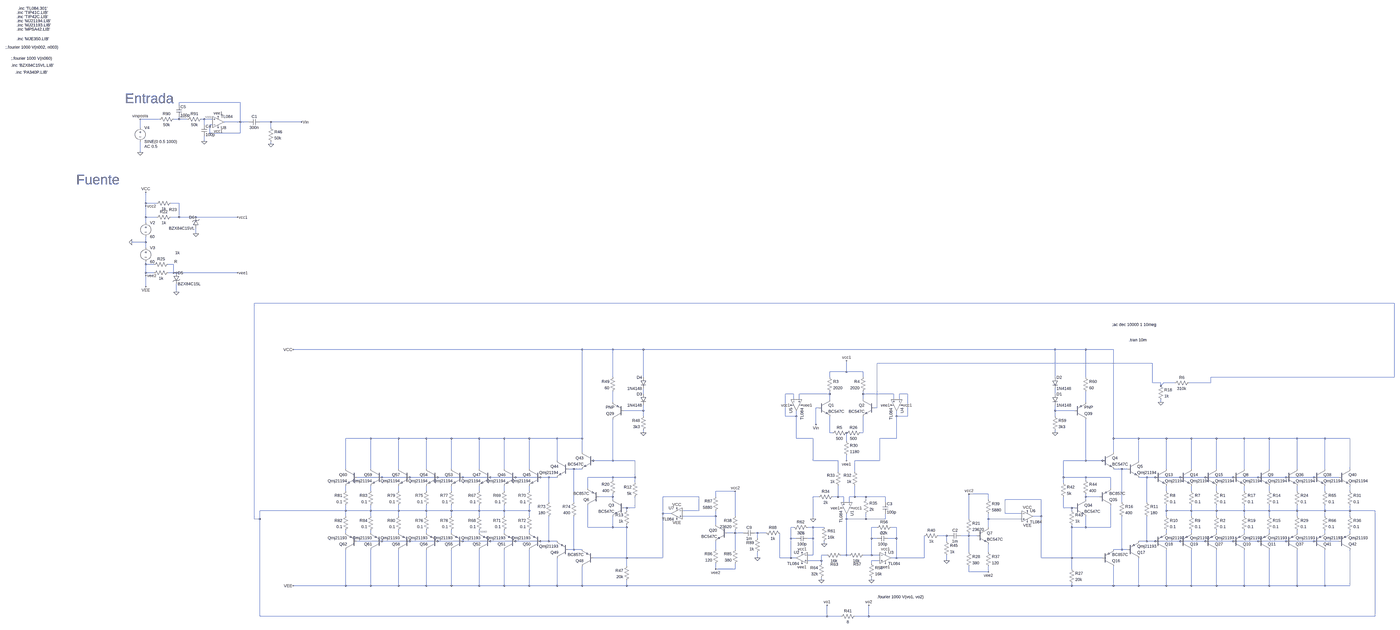
[diagram p0: schematic V6.asc, whole sheet]
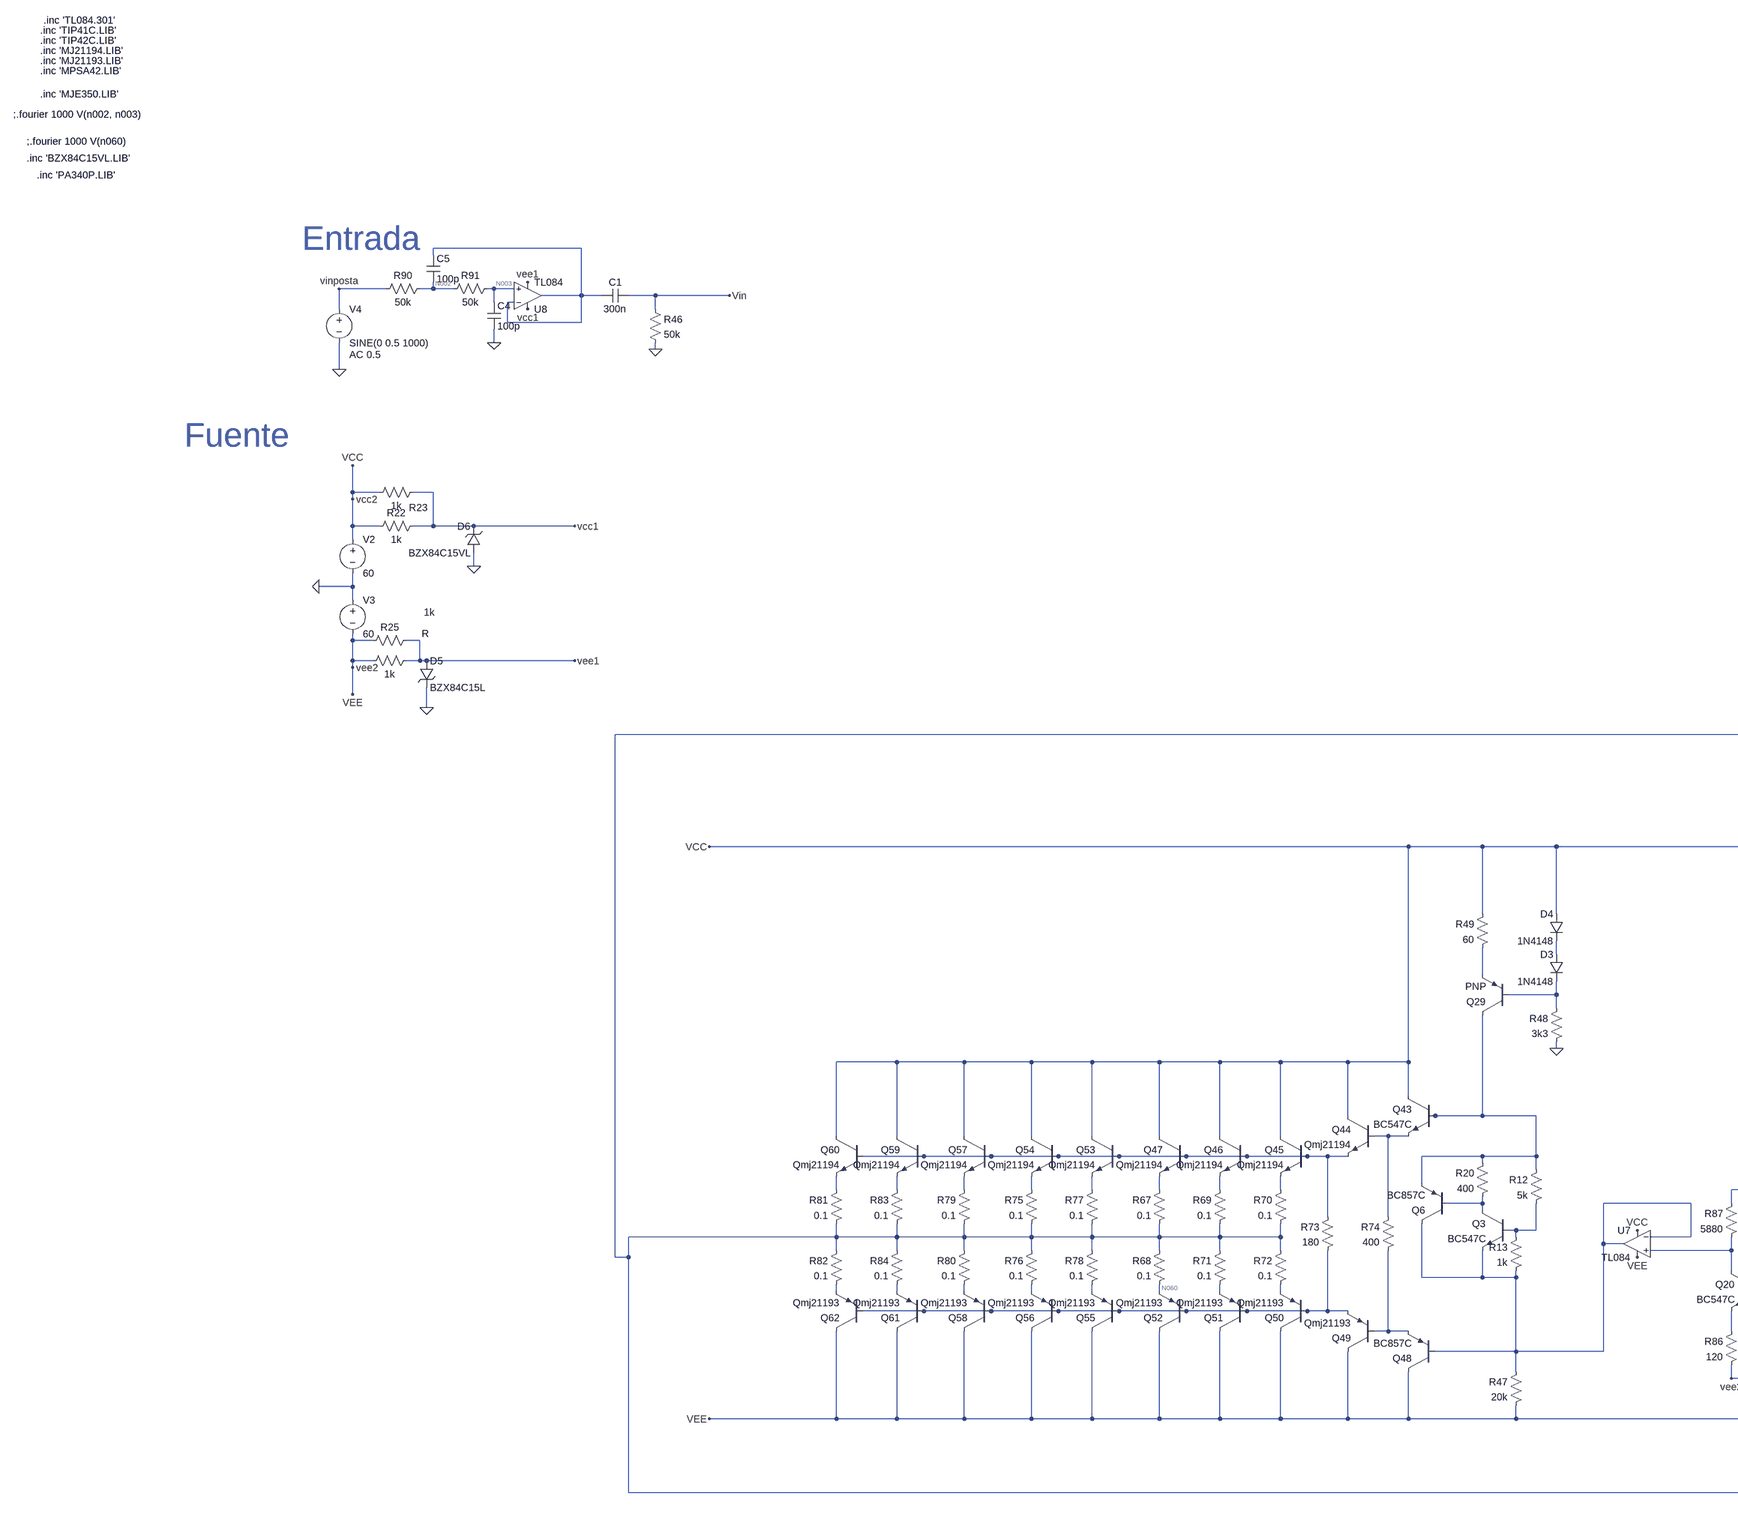
[diagram p1: schematic V6.asc, part, row 1 of 1, column 1 of 2]
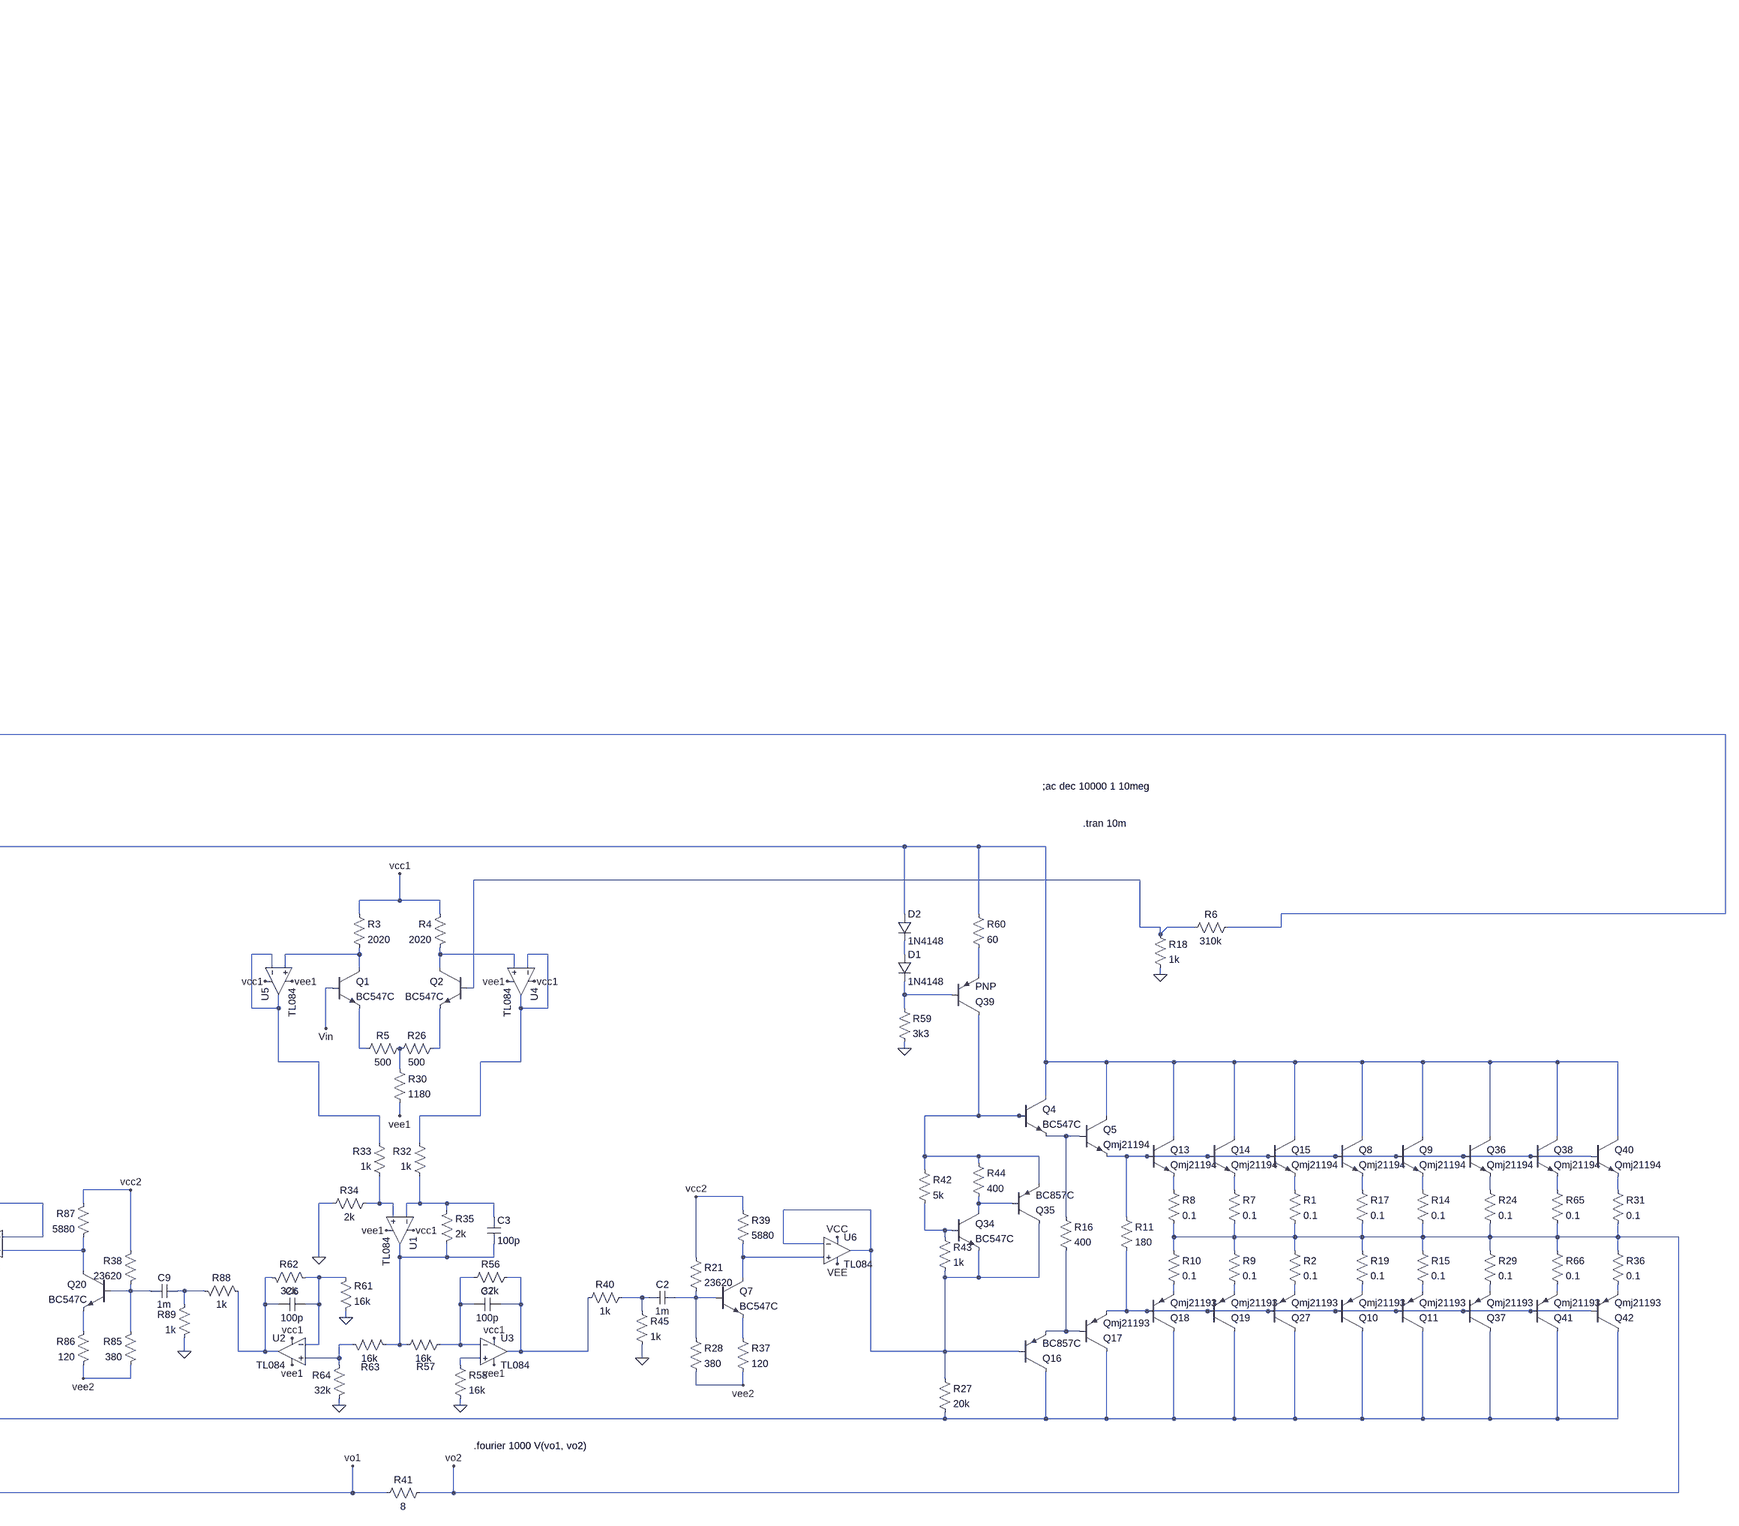
[diagram p2: schematic V6.asc, part, row 1 of 1, column 2 of 2]
V6.asc, the LTspice schematic file:
Version 4
SHEET 1 14776 5396
WIRE 4192 -160 3840 -160
WIRE 3840 -144 3840 -160
WIRE 3728 -64 3616 -64
WIRE 3840 -64 3840 -80
WIRE 3840 -64 3808 -64
WIRE 3888 -64 3840 -64
WIRE 3984 -64 3968 -64
WIRE 4032 -64 3984 -64
WIRE 4192 -48 4192 -160
WIRE 4192 -48 4096 -48
WIRE 4240 -48 4192 -48
WIRE 4368 -48 4304 -48
WIRE 4544 -48 4368 -48
WIRE 3984 -32 3984 -64
WIRE 4032 -32 4016 -32
WIRE 3616 -16 3616 -64
WIRE 4368 -16 4368 -48
WIRE 4016 16 4016 -32
WIRE 4192 16 4192 -48
WIRE 4192 16 4016 16
WIRE 3984 64 3984 32
WIRE 4368 80 4368 64
WIRE 3616 128 3616 64
WIRE 3648 976 3648 912
WIRE 3712 976 3648 976
WIRE 3840 976 3792 976
WIRE 3648 992 3648 976
WIRE 3648 1056 3648 992
WIRE 3712 1056 3648 1056
WIRE 3840 1056 3840 976
WIRE 3840 1056 3792 1056
WIRE 3936 1056 3840 1056
WIRE 4176 1056 3936 1056
WIRE 3648 1088 3648 1056
WIRE 3936 1152 3936 1120
WIRE 3648 1200 3648 1168
WIRE 3648 1200 3568 1200
WIRE 3648 1232 3648 1200
WIRE 3648 1328 3648 1312
WIRE 3696 1328 3648 1328
WIRE 3808 1328 3776 1328
WIRE 3648 1376 3648 1328
WIRE 3696 1376 3648 1376
WIRE 3808 1376 3808 1328
WIRE 3808 1376 3776 1376
WIRE 3824 1376 3808 1376
WIRE 4176 1376 3824 1376
WIRE 3648 1392 3648 1376
WIRE 3648 1456 3648 1392
WIRE 3824 1488 3824 1440
WIRE 10832 1552 4272 1552
WIRE 6160 2000 4496 2000
WIRE 6336 2000 6160 2000
WIRE 6512 2000 6336 2000
WIRE 8880 2000 6512 2000
WIRE 9056 2000 8880 2000
WIRE 9216 2000 9056 2000
WIRE 9440 2080 7856 2080
WIRE 7680 2128 7680 2064
WIRE 7680 2128 7584 2128
WIRE 7776 2128 7680 2128
WIRE 6336 2160 6336 2000
WIRE 6512 2160 6512 2000
WIRE 7584 2160 7584 2128
WIRE 7776 2160 7776 2128
WIRE 8880 2160 8880 2000
WIRE 9056 2160 9056 2000
WIRE 10832 2160 10832 1552
WIRE 10832 2160 9776 2160
WIRE 9440 2192 9440 2080
WIRE 9488 2192 9440 2192
WIRE 9568 2192 9504 2192
WIRE 9776 2192 9776 2160
WIRE 9776 2192 9648 2192
WIRE 9488 2208 9488 2192
WIRE 9488 2208 9504 2192
WIRE 6512 2256 6512 2224
WIRE 7376 2256 7328 2256
WIRE 7584 2256 7584 2240
WIRE 7584 2256 7408 2256
WIRE 7776 2256 7776 2240
WIRE 7952 2256 7776 2256
WIRE 8032 2256 7984 2256
WIRE 8880 2256 8880 2224
WIRE 7376 2288 7376 2256
WIRE 7408 2288 7408 2256
WIRE 7584 2288 7584 2256
WIRE 7776 2288 7776 2256
WIRE 7952 2288 7952 2256
WIRE 7984 2288 7984 2256
WIRE 6336 2304 6336 2240
WIRE 9056 2304 9056 2240
WIRE 9488 2304 9488 2288
WIRE 7520 2336 7504 2336
WIRE 7856 2336 7856 2080
WIRE 7856 2336 7840 2336
WIRE 6512 2352 6512 2320
WIRE 6512 2352 6400 2352
WIRE 8880 2352 8880 2320
WIRE 8992 2352 8880 2352
WIRE 6512 2384 6512 2352
WIRE 7328 2384 7328 2256
WIRE 7392 2384 7392 2352
WIRE 7392 2384 7328 2384
WIRE 7968 2384 7968 2352
WIRE 8032 2384 8032 2256
WIRE 8032 2384 7968 2384
WIRE 8880 2384 8880 2352
WIRE 7504 2432 7504 2336
WIRE 6512 2480 6512 2464
WIRE 7584 2480 7584 2384
WIRE 7600 2480 7584 2480
WIRE 7776 2480 7776 2384
WIRE 7776 2480 7760 2480
WIRE 8880 2480 8880 2464
WIRE 4944 2512 4800 2512
WIRE 5104 2512 4944 2512
WIRE 5264 2512 5104 2512
WIRE 5408 2512 5264 2512
WIRE 5568 2512 5408 2512
WIRE 5712 2512 5568 2512
WIRE 5856 2512 5712 2512
WIRE 6016 2512 5856 2512
WIRE 6160 2512 6160 2000
WIRE 6160 2512 6016 2512
WIRE 7392 2512 7392 2384
WIRE 7488 2512 7392 2512
WIRE 7968 2512 7968 2384
WIRE 7968 2512 7872 2512
WIRE 9216 2512 9216 2000
WIRE 9360 2512 9216 2512
WIRE 9520 2512 9360 2512
WIRE 9664 2512 9520 2512
WIRE 9808 2512 9664 2512
WIRE 9968 2512 9808 2512
WIRE 10112 2512 9968 2512
WIRE 10272 2512 10112 2512
WIRE 10432 2512 10272 2512
WIRE 10576 2512 10432 2512
WIRE 7680 2528 7680 2480
WIRE 6160 2592 6160 2512
WIRE 9216 2592 9216 2512
WIRE 6016 2640 6016 2512
WIRE 6224 2640 6208 2640
WIRE 6336 2640 6336 2400
WIRE 6336 2640 6224 2640
WIRE 6464 2640 6336 2640
WIRE 7488 2640 7488 2512
WIRE 7632 2640 7488 2640
WIRE 7680 2640 7680 2608
WIRE 7872 2640 7872 2512
WIRE 7872 2640 7728 2640
WIRE 9056 2640 9056 2400
WIRE 9056 2640 8928 2640
WIRE 9152 2640 9056 2640
WIRE 9168 2640 9152 2640
WIRE 9360 2640 9360 2512
WIRE 4800 2688 4800 2512
WIRE 4944 2688 4944 2512
WIRE 5104 2688 5104 2512
WIRE 5264 2688 5264 2512
WIRE 5408 2688 5408 2512
WIRE 5568 2688 5568 2512
WIRE 5712 2688 5712 2512
WIRE 5856 2688 5856 2512
WIRE 6112 2688 6080 2688
WIRE 6160 2688 6112 2688
WIRE 9264 2688 9216 2688
WIRE 9296 2688 9264 2688
WIRE 9520 2688 9520 2512
WIRE 9664 2688 9664 2512
WIRE 9808 2688 9808 2512
WIRE 9968 2688 9968 2512
WIRE 10112 2688 10112 2512
WIRE 10272 2688 10272 2512
WIRE 10432 2688 10432 2512
WIRE 10576 2688 10576 2512
WIRE 7632 2704 7632 2640
WIRE 7728 2704 7728 2640
WIRE 5008 2736 4864 2736
WIRE 5168 2736 5008 2736
WIRE 5328 2736 5168 2736
WIRE 5472 2736 5328 2736
WIRE 5632 2736 5472 2736
WIRE 5776 2736 5632 2736
WIRE 5920 2736 5776 2736
WIRE 5968 2736 5920 2736
WIRE 6016 2736 5968 2736
WIRE 6336 2736 6192 2736
WIRE 6464 2736 6464 2640
WIRE 6464 2736 6336 2736
WIRE 8928 2736 8928 2640
WIRE 9056 2736 8928 2736
WIRE 9200 2736 9056 2736
WIRE 9408 2736 9360 2736
WIRE 9456 2736 9408 2736
WIRE 9600 2736 9456 2736
WIRE 9744 2736 9600 2736
WIRE 9904 2736 9744 2736
WIRE 10048 2736 9904 2736
WIRE 10208 2736 10048 2736
WIRE 10368 2736 10208 2736
WIRE 10512 2736 10368 2736
WIRE 6336 2752 6336 2736
WIRE 9056 2752 9056 2736
WIRE 6464 2768 6464 2736
WIRE 8928 2768 8928 2736
WIRE 6192 2800 6192 2736
WIRE 9200 2800 9200 2736
WIRE 4800 2816 4800 2784
WIRE 4944 2816 4944 2784
WIRE 5104 2816 5104 2784
WIRE 5264 2816 5264 2784
WIRE 5408 2816 5408 2784
WIRE 5568 2816 5568 2784
WIRE 5712 2816 5712 2784
WIRE 5856 2816 5856 2784
WIRE 7040 2816 6928 2816
WIRE 9520 2816 9520 2784
WIRE 9664 2816 9664 2784
WIRE 9808 2816 9808 2784
WIRE 9968 2816 9968 2784
WIRE 10112 2816 10112 2784
WIRE 10272 2816 10272 2784
WIRE 10432 2816 10432 2784
WIRE 10576 2816 10576 2784
WIRE 8496 2832 8384 2832
WIRE 6336 2848 6336 2832
WIRE 6336 2848 6256 2848
WIRE 6832 2848 6624 2848
WIRE 6928 2848 6928 2816
WIRE 7520 2848 7488 2848
WIRE 7632 2848 7632 2784
WIRE 7632 2848 7600 2848
WIRE 7664 2848 7632 2848
WIRE 7728 2848 7728 2784
WIRE 7728 2848 7696 2848
WIRE 7792 2848 7728 2848
WIRE 7904 2848 7792 2848
WIRE 9056 2848 9056 2832
WIRE 9136 2848 9056 2848
WIRE 6336 2864 6336 2848
WIRE 7792 2864 7792 2848
WIRE 8496 2864 8496 2832
WIRE 8800 2864 8592 2864
WIRE 9056 2864 9056 2848
WIRE 5968 2880 5968 2736
WIRE 6112 2880 6112 2688
WIRE 7664 2880 7664 2848
WIRE 7696 2880 7696 2848
WIRE 7904 2880 7904 2848
WIRE 9264 2880 9264 2688
WIRE 9408 2880 9408 2736
WIRE 6416 2912 6400 2912
WIRE 6464 2912 6464 2848
WIRE 6464 2912 6416 2912
WIRE 8928 2912 8928 2848
WIRE 8976 2912 8928 2912
WIRE 8992 2912 8976 2912
WIRE 4800 2928 4800 2896
WIRE 4800 2928 4304 2928
WIRE 4944 2928 4944 2896
WIRE 4944 2928 4800 2928
WIRE 5104 2928 5104 2896
WIRE 5104 2928 4944 2928
WIRE 5264 2928 5264 2896
WIRE 5264 2928 5104 2928
WIRE 5408 2928 5408 2896
WIRE 5408 2928 5264 2928
WIRE 5568 2928 5568 2896
WIRE 5568 2928 5408 2928
WIRE 5712 2928 5712 2896
WIRE 5712 2928 5568 2928
WIRE 5856 2928 5856 2896
WIRE 5856 2928 5712 2928
WIRE 6416 2928 6416 2912
WIRE 6832 2928 6832 2848
WIRE 6832 2928 6736 2928
WIRE 8976 2928 8976 2912
WIRE 9520 2928 9520 2896
WIRE 9664 2928 9664 2896
WIRE 9664 2928 9520 2928
WIRE 9808 2928 9808 2896
WIRE 9808 2928 9664 2928
WIRE 9968 2928 9968 2896
WIRE 9968 2928 9808 2928
WIRE 10112 2928 10112 2896
WIRE 10112 2928 9968 2928
WIRE 10272 2928 10272 2896
WIRE 10272 2928 10112 2928
WIRE 10432 2928 10432 2896
WIRE 10432 2928 10272 2928
WIRE 10576 2928 10576 2896
WIRE 10576 2928 10432 2928
WIRE 10720 2928 10576 2928
WIRE 6624 2944 6624 2848
WIRE 6672 2944 6624 2944
WIRE 8592 2944 8592 2864
WIRE 8688 2944 8592 2944
WIRE 4800 2960 4800 2928
WIRE 4944 2960 4944 2928
WIRE 5104 2960 5104 2928
WIRE 5264 2960 5264 2928
WIRE 5408 2960 5408 2928
WIRE 5568 2960 5568 2928
WIRE 5712 2960 5712 2928
WIRE 5856 2960 5856 2928
WIRE 6928 2960 6928 2928
WIRE 6928 2960 6736 2960
WIRE 7040 2960 7040 2816
WIRE 8800 2960 8800 2864
WIRE 8800 2960 8752 2960
WIRE 9520 2960 9520 2928
WIRE 9664 2960 9664 2928
WIRE 9808 2960 9808 2928
WIRE 9968 2960 9968 2928
WIRE 10112 2960 10112 2928
WIRE 10272 2960 10272 2928
WIRE 10432 2960 10432 2928
WIRE 10576 2960 10576 2928
WIRE 4272 2976 4272 1552
WIRE 4304 2976 4304 2928
WIRE 4304 2976 4272 2976
WIRE 7488 2976 7488 2848
WIRE 7680 2976 7680 2944
WIRE 7792 2976 7792 2944
WIRE 7792 2976 7680 2976
WIRE 7904 2976 7904 2944
WIRE 7904 2976 7792 2976
WIRE 8384 2976 8384 2832
WIRE 8496 2976 8496 2944
WIRE 8688 2976 8496 2976
WIRE 6928 3008 6928 2960
WIRE 6192 3024 6192 2896
WIRE 6336 3024 6336 2960
WIRE 6336 3024 6192 3024
WIRE 6416 3024 6416 3008
WIRE 6416 3024 6336 3024
WIRE 7376 3024 7360 3024
WIRE 7488 3024 7456 3024
WIRE 7552 3024 7488 3024
WIRE 7856 3024 7824 3024
WIRE 7968 3024 7936 3024
WIRE 8496 3024 8496 2976
WIRE 8976 3024 8976 3008
WIRE 9056 3024 9056 2960
WIRE 9056 3024 8976 3024
WIRE 9200 3024 9200 2896
WIRE 9200 3024 9056 3024
WIRE 4800 3056 4800 3040
WIRE 4944 3056 4944 3040
WIRE 5104 3056 5104 3040
WIRE 5264 3056 5264 3040
WIRE 5408 3056 5408 3040
WIRE 5568 3056 5568 3040
WIRE 5712 3056 5712 3040
WIRE 5856 3056 5856 3040
WIRE 7040 3056 7040 3040
WIRE 7040 3056 6992 3056
WIRE 7088 3056 7040 3056
WIRE 7168 3056 7152 3056
WIRE 7216 3056 7168 3056
WIRE 9520 3056 9520 3040
WIRE 9664 3056 9664 3040
WIRE 9808 3056 9808 3040
WIRE 9968 3056 9968 3040
WIRE 10112 3056 10112 3040
WIRE 10272 3056 10272 3040
WIRE 10432 3056 10432 3040
WIRE 10576 3056 10576 3040
WIRE 8256 3072 8208 3072
WIRE 8272 3072 8256 3072
WIRE 8384 3072 8384 3056
WIRE 8384 3072 8336 3072
WIRE 8432 3072 8384 3072
WIRE 7168 3088 7168 3056
WIRE 7360 3088 7360 3024
WIRE 7392 3088 7360 3088
WIRE 7488 3088 7488 3024
WIRE 7488 3088 7456 3088
WIRE 7824 3088 7824 3024
WIRE 7856 3088 7824 3088
WIRE 7968 3088 7968 3024
WIRE 7968 3088 7920 3088
WIRE 5008 3104 4864 3104
WIRE 5168 3104 5008 3104
WIRE 5328 3104 5168 3104
WIRE 5472 3104 5328 3104
WIRE 5632 3104 5472 3104
WIRE 5776 3104 5632 3104
WIRE 5920 3104 5776 3104
WIRE 5968 3104 5968 2960
WIRE 5968 3104 5920 3104
WIRE 6016 3104 5968 3104
WIRE 8256 3104 8256 3072
WIRE 9408 3104 9408 2960
WIRE 9408 3104 9360 3104
WIRE 9456 3104 9408 3104
WIRE 9600 3104 9456 3104
WIRE 9744 3104 9600 3104
WIRE 9904 3104 9744 3104
WIRE 10048 3104 9904 3104
WIRE 10208 3104 10048 3104
WIRE 10368 3104 10208 3104
WIRE 10512 3104 10368 3104
WIRE 7552 3120 7552 3104
WIRE 6112 3152 6112 2960
WIRE 6112 3152 6080 3152
WIRE 6160 3152 6112 3152
WIRE 6928 3152 6928 3104
WIRE 7040 3152 7040 3056
WIRE 9264 3152 9264 2960
WIRE 9264 3152 9216 3152
WIRE 9296 3152 9264 3152
WIRE 8384 3168 8384 3072
WIRE 8496 3168 8496 3120
WIRE 7488 3184 7488 3088
WIRE 7488 3184 7456 3184
WIRE 7568 3184 7536 3184
WIRE 7680 3184 7680 2976
WIRE 7680 3184 7648 3184
WIRE 7696 3184 7680 3184
WIRE 7824 3184 7824 3088
WIRE 7824 3184 7776 3184
WIRE 7872 3184 7824 3184
WIRE 6416 3200 6416 3024
WIRE 6416 3200 6224 3200
WIRE 6624 3200 6624 2944
WIRE 6624 3200 6416 3200
WIRE 7168 3200 7168 3168
WIRE 7296 3200 7296 3056
WIRE 7360 3200 7360 3088
WIRE 7360 3200 7296 3200
WIRE 7392 3200 7360 3200
WIRE 7968 3200 7968 3088
WIRE 7968 3200 7936 3200
WIRE 8128 3200 8128 3072
WIRE 8128 3200 7968 3200
WIRE 8800 3200 8800 2960
WIRE 8976 3200 8976 3024
WIRE 8976 3200 8800 3200
WIRE 9152 3200 8976 3200
WIRE 7536 3216 7536 3184
WIRE 7536 3216 7456 3216
WIRE 7872 3216 7824 3216
WIRE 8256 3216 8256 3184
WIRE 7536 3232 7536 3216
WIRE 7824 3232 7824 3216
WIRE 6416 3248 6416 3200
WIRE 6928 3264 6928 3232
WIRE 7040 3264 7040 3232
WIRE 7040 3264 6928 3264
WIRE 8976 3264 8976 3200
WIRE 8384 3280 8384 3248
WIRE 8496 3280 8496 3248
WIRE 8496 3280 8384 3280
WIRE 7536 3328 7536 3312
WIRE 7824 3328 7824 3312
WIRE 4800 3360 4800 3152
WIRE 4800 3360 4496 3360
WIRE 4944 3360 4944 3152
WIRE 4944 3360 4800 3360
WIRE 5104 3360 5104 3152
WIRE 5104 3360 4944 3360
WIRE 5264 3360 5264 3152
WIRE 5264 3360 5104 3360
WIRE 5408 3360 5408 3152
WIRE 5408 3360 5264 3360
WIRE 5568 3360 5568 3152
WIRE 5568 3360 5408 3360
WIRE 5712 3360 5712 3152
WIRE 5712 3360 5568 3360
WIRE 5856 3360 5856 3152
WIRE 5856 3360 5712 3360
WIRE 6016 3360 6016 3200
WIRE 6016 3360 5856 3360
WIRE 6160 3360 6160 3248
WIRE 6160 3360 6016 3360
WIRE 6416 3360 6416 3328
WIRE 6416 3360 6160 3360
WIRE 8976 3360 8976 3344
WIRE 8976 3360 6416 3360
WIRE 9216 3360 9216 3248
WIRE 9216 3360 8976 3360
WIRE 9360 3360 9360 3200
WIRE 9360 3360 9216 3360
WIRE 9520 3360 9520 3152
WIRE 9520 3360 9360 3360
WIRE 9664 3360 9664 3152
WIRE 9664 3360 9520 3360
WIRE 9808 3360 9808 3152
WIRE 9808 3360 9664 3360
WIRE 9968 3360 9968 3152
WIRE 9968 3360 9808 3360
WIRE 10112 3360 10112 3152
WIRE 10112 3360 9968 3360
WIRE 10272 3360 10272 3152
WIRE 10272 3360 10112 3360
WIRE 10432 3360 10432 3152
WIRE 10432 3360 10272 3360
WIRE 10576 3360 10576 3152
WIRE 10576 3360 10432 3360
WIRE 4304 3536 4304 2976
WIRE 7568 3536 7568 3472
WIRE 7568 3536 4304 3536
WIRE 7648 3536 7568 3536
WIRE 7808 3536 7808 3472
WIRE 7808 3536 7728 3536
WIRE 10720 3536 10720 2928
WIRE 10720 3536 7808 3536
FLAG 3568 1200 0
FLAG 3616 128 0
FLAG 4544 -48 Vin
FLAG 3648 912 VCC
FLAG 3648 1456 VEE
FLAG 7680 2640 vee1
FLAG 7648 2912 vee1
FLAG 7680 2064 vcc1
FLAG 7712 2912 vcc1
FLAG 3648 992 vcc2
FLAG 3648 1392 vee2
FLAG 8880 2480 0
FLAG 6512 2480 0
FLAG 4496 3360 VEE
FLAG 4496 2000 VCC
FLAG 7488 2976 0
FLAG 7824 3328 0
FLAG 7552 3120 0
FLAG 7536 3328 0
FLAG 3936 1152 0
FLAG 3824 1488 0
FLAG 7568 3472 vo1
FLAG 7808 3472 vo2
FLAG 8000 2320 vcc1
FLAG 7936 2320 vee1
FLAG 7360 2320 vcc1
FLAG 7424 2320 vee1
FLAG 7904 3232 vee1
FLAG 7424 3232 vee1
FLAG 7424 3168 vcc1
FLAG 7904 3168 vcc1
FLAG 4176 1056 vcc1
FLAG 4176 1376 vee1
FLAG 7504 2432 Vin
FLAG 8384 2832 vcc2
FLAG 8496 3280 vee2
FLAG 8256 3216 0
FLAG 8720 2928 VCC
FLAG 8720 2992 VEE
FLAG 7040 2816 vcc2
FLAG 6928 3264 vee2
FLAG 7168 3200 0
FLAG 6704 2912 VCC
FLAG 6704 2976 VEE
FLAG 9488 2304 0
FLAG 3984 64 0
FLAG 4064 -16 vcc1
FLAG 4064 -80 vee1
FLAG 3616 -64 vinposta
FLAG 4368 80 0
SYMBOL npn 9152 2592 R0
SYMATTR InstName Q4
SYMATTR Value BC547C
SYMBOL npn 9296 2640 R0
SYMATTR InstName Q5
SYMATTR Value Qmj21194
SYMBOL npn 9456 2688 R0
SYMATTR InstName Q13
SYMATTR Value Qmj21194
SYMBOL npn 9600 2688 R0
SYMATTR InstName Q14
SYMATTR Value Qmj21194
SYMBOL npn 9744 2688 R0
SYMATTR InstName Q15
SYMATTR Value Qmj21194
SYMBOL pnp 9152 3248 M180
SYMATTR InstName Q16
SYMATTR Value BC857C
SYMBOL pnp 9296 3200 M180
SYMATTR InstName Q17
SYMATTR Value Qmj21193
SYMBOL pnp 9456 3152 M180
SYMATTR InstName Q18
SYMATTR Value Qmj21193
SYMBOL pnp 9600 3152 M180
SYMATTR InstName Q19
SYMATTR Value Qmj21193
SYMBOL pnp 9744 3152 M180
SYMATTR InstName Q27
SYMATTR Value Qmj21193
SYMBOL res 9792 2800 R0
SYMATTR InstName R1
SYMATTR Value 0.1
SYMBOL res 9792 2944 R0
SYMATTR InstName R2
SYMATTR Value 0.1
SYMBOL res 9648 2800 R0
SYMATTR InstName R7
SYMATTR Value 0.1
SYMBOL res 9504 2800 R0
SYMATTR InstName R8
SYMATTR Value 0.1
SYMBOL res 9648 2944 R0
SYMATTR InstName R9
SYMATTR Value 0.1
SYMBOL res 9504 2944 R0
SYMATTR InstName R10
SYMATTR Value 0.1
SYMBOL res 9392 2864 R0
SYMATTR InstName R11
SYMATTR Value 180
SYMBOL res 9248 2864 R0
SYMATTR InstName R16
SYMATTR Value 400
SYMBOL npn 8992 2864 R0
SYMATTR InstName Q34
SYMATTR Value BC547C
SYMBOL res 8912 2752 R0
SYMATTR InstName R42
SYMATTR Value 5k
SYMBOL res 8960 2912 R0
SYMATTR InstName R43
SYMATTR Value 1k
SYMBOL res 9040 2736 R0
SYMATTR InstName R44
SYMATTR Value 400
SYMBOL pnp 9136 2896 M180
SYMATTR InstName Q35
SYMATTR Value BC857C
SYMBOL voltage 3648 1072 R0
WINDOW 123 0 0 Left 0
WINDOW 39 24 44 Left 2
SYMATTR InstName V2
SYMATTR Value 60
SYMBOL voltage 3648 1216 R0
WINDOW 123 0 0 Left 0
WINDOW 39 24 124 Left 2
SYMATTR InstName V3
SYMATTR Value 60
SYMBOL voltage 3616 -32 R0
WINDOW 123 24 124 Left 2
WINDOW 39 0 0 Left 0
SYMATTR Value2 AC 0.5
SYMATTR InstName V4
SYMATTR Value SINE(0 0.5 1000)
SYMBOL npn 7520 2288 R0
SYMATTR InstName Q1
SYMATTR Value BC547C
SYMBOL npn 7840 2288 M0
SYMATTR InstName Q2
SYMATTR Value BC547C
SYMBOL res 7568 2144 R0
SYMATTR InstName R3
SYMATTR Value 2020
SYMBOL res 7792 2144 M0
SYMATTR InstName R4
SYMATTR Value 2020
SYMBOL res 7696 2464 R90
WINDOW 0 0 56 VBottom 2
WINDOW 3 32 56 VTop 2
SYMATTR InstName R5
SYMATTR Value 500
SYMBOL res 7776 2464 R90
WINDOW 0 0 56 VBottom 2
WINDOW 3 32 56 VTop 2
SYMATTR InstName R26
SYMATTR Value 500
SYMBOL res 7664 2512 R0
SYMATTR InstName R30
SYMATTR Value 1180
SYMBOL Opamps\\opamp2 7744 2912 R90
SYMATTR InstName U1
SYMATTR Value TL084
SYMBOL res 7744 2800 R180
WINDOW 0 36 76 Left 2
WINDOW 3 36 40 Left 2
SYMATTR InstName R32
SYMATTR Value 1k
SYMBOL res 7648 2800 R180
WINDOW 0 36 76 Left 2
WINDOW 3 36 40 Left 2
SYMATTR InstName R33
SYMATTR Value 1k
SYMBOL res 7616 2832 R90
WINDOW 0 0 56 VBottom 2
WINDOW 3 32 56 VTop 2
SYMATTR InstName R34
SYMATTR Value 2k
SYMBOL res 7776 2960 M180
WINDOW 0 36 76 Left 2
WINDOW 3 36 40 Left 2
SYMATTR InstName R35
SYMATTR Value 2k
SYMBOL res 8960 3248 R0
SYMATTR InstName R27
SYMATTR Value 20k
SYMBOL pnp 8992 2400 M180
SYMATTR InstName Q39
SYMBOL res 8864 2368 R0
SYMATTR InstName R59
SYMATTR Value 3k3
SYMBOL diode 8864 2256 R0
SYMATTR InstName D1
SYMATTR Value 1N4148
SYMBOL diode 8864 2160 R0
SYMATTR InstName D2
SYMATTR Value 1N4148
SYMBOL res 9040 2144 R0
SYMATTR InstName R60
SYMATTR Value 60
SYMBOL npn 9904 2688 R0
SYMATTR InstName Q8
SYMATTR Value Qmj21194
SYMBOL npn 10048 2688 R0
SYMATTR InstName Q9
SYMATTR Value Qmj21194
SYMBOL pnp 9904 3152 M180
SYMATTR InstName Q10
SYMATTR Value Qmj21193
SYMBOL pnp 10048 3152 M180
SYMATTR InstName Q11
SYMATTR Value Qmj21193
SYMBOL res 10096 2800 R0
SYMATTR InstName R14
SYMATTR Value 0.1
SYMBOL res 10096 2944 R0
SYMATTR InstName R15
SYMATTR Value 0.1
SYMBOL res 9952 2800 R0
SYMATTR InstName R17
SYMATTR Value 0.1
SYMBOL res 9952 2944 R0
SYMATTR InstName R19
SYMATTR Value 0.1
SYMBOL res 6432 3232 M0
SYMATTR InstName R47
SYMATTR Value 20k
SYMBOL pnp 6400 2400 R180
SYMATTR InstName Q29
SYMBOL res 6528 2368 M0
SYMATTR InstName R48
SYMATTR Value 3k3
SYMBOL diode 6528 2256 M0
SYMATTR InstName D3
SYMATTR Value 1N4148
SYMBOL diode 6528 2160 M0
SYMATTR InstName D4
SYMATTR Value 1N4148
SYMBOL res 6352 2144 M0
SYMATTR InstName R49
SYMATTR Value 60
SYMBOL res 7744 3520 R90
WINDOW 0 0 56 VBottom 2
WINDOW 3 32 56 VTop 2
SYMATTR InstName R41
SYMATTR Value 8
SYMBOL res 7952 3008 R90
WINDOW 0 0 56 VBottom 2
WINDOW 3 32 56 VTop 2
SYMATTR InstName R56
SYMATTR Value 32k
SYMBOL res 7792 3168 R90
WINDOW 0 83 50 VBottom 2
WINDOW 3 32 56 VTop 2
SYMATTR InstName R57
SYMATTR Value 16k
SYMBOL res 7808 3216 R0
SYMATTR InstName R58
SYMATTR Value 16k
SYMBOL res 7536 3120 M180
WINDOW 0 36 76 Left 2
WINDOW 3 36 40 Left 2
SYMATTR InstName R61
SYMATTR Value 16k
SYMBOL res 7360 3008 M90
WINDOW 0 0 56 VBottom 2
WINDOW 3 32 56 VTop 2
SYMATTR InstName R62
SYMATTR Value 32k
SYMBOL res 7664 3200 M270
WINDOW 0 -52 54 VTop 2
WINDOW 3 0 56 VBottom 2
SYMATTR InstName R63
SYMATTR Value 16k
SYMBOL res 7552 3216 M0
SYMATTR InstName R64
SYMATTR Value 32k
SYMBOL res 3808 1040 R90
WINDOW 0 0 56 VBottom 2
WINDOW 3 32 56 VTop 2
SYMATTR InstName R22
SYMATTR Value 1k
SYMBOL res 3792 1360 R90
WINDOW 0 -33 -29 VBottom 2
WINDOW 3 32 56 VTop 2
SYMATTR InstName R
SYMATTR Value 1k
SYMBOL zener 3808 1376 R0
SYMATTR InstName D5
SYMATTR Value BZX84C15L
SYMBOL zener 3952 1120 R180
WINDOW 0 24 64 Left 2
WINDOW 3 24 0 Left 2
SYMATTR InstName D6
SYMATTR Value BZX84C15VL
SYMBOL res 3808 960 R90
WINDOW 0 67 4 VBottom 2
WINDOW 3 32 56 VTop 2
SYMATTR InstName R23
SYMATTR Value 1k
SYMBOL res 3792 1312 R90
WINDOW 0 0 56 VBottom 2
WINDOW 3 -67 -38 VTop 2
SYMATTR InstName R25
SYMATTR Value 1k
SYMBOL npn 10208 2688 R0
SYMATTR InstName Q36
SYMATTR Value Qmj21194
SYMBOL pnp 10208 3152 M180
SYMATTR InstName Q37
SYMATTR Value Qmj21193
SYMBOL res 10256 2800 R0
SYMATTR InstName R24
SYMATTR Value 0.1
SYMBOL res 10256 2944 R0
SYMATTR InstName R29
SYMATTR Value 0.1
SYMBOL npn 10368 2688 R0
SYMATTR InstName Q38
SYMATTR Value Qmj21194
SYMBOL npn 10512 2688 R0
SYMATTR InstName Q40
SYMATTR Value Qmj21194
SYMBOL pnp 10368 3152 M180
SYMATTR InstName Q41
SYMATTR Value Qmj21193
SYMBOL pnp 10512 3152 M180
SYMATTR InstName Q42
SYMATTR Value Qmj21193
SYMBOL res 10560 2800 R0
SYMATTR InstName R31
SYMATTR Value 0.1
SYMBOL res 10560 2944 R0
SYMATTR InstName R36
SYMATTR Value 0.1
SYMBOL res 10416 2800 R0
SYMATTR InstName R65
SYMATTR Value 0.1
SYMBOL res 10416 2944 R0
SYMATTR InstName R66
SYMATTR Value 0.1
SYMBOL npn 6224 2592 M0
SYMATTR InstName Q43
SYMATTR Value BC547C
SYMBOL npn 6080 2640 M0
SYMATTR InstName Q44
SYMATTR Value Qmj21194
SYMBOL npn 5920 2688 M0
SYMATTR InstName Q45
SYMATTR Value Qmj21194
SYMBOL npn 5776 2688 M0
SYMATTR InstName Q46
SYMATTR Value Qmj21194
SYMBOL npn 5632 2688 M0
SYMATTR InstName Q47
SYMATTR Value Qmj21194
SYMBOL pnp 6224 3248 R180
SYMATTR InstName Q48
SYMATTR Value BC857C
SYMBOL pnp 6080 3200 R180
SYMATTR InstName Q49
SYMATTR Value Qmj21193
SYMBOL pnp 5920 3152 R180
SYMATTR InstName Q50
SYMATTR Value Qmj21193
SYMBOL pnp 5776 3152 R180
SYMATTR InstName Q51
SYMATTR Value Qmj21193
SYMBOL pnp 5632 3152 R180
SYMATTR InstName Q52
SYMATTR Value Qmj21193
SYMBOL res 5584 2800 M0
SYMATTR InstName R67
SYMATTR Value 0.1
SYMBOL res 5584 2944 M0
SYMATTR InstName R68
SYMATTR Value 0.1
SYMBOL res 5728 2800 M0
SYMATTR InstName R69
SYMATTR Value 0.1
SYMBOL res 5872 2800 M0
SYMATTR InstName R70
SYMATTR Value 0.1
SYMBOL res 5728 2944 M0
SYMATTR InstName R71
SYMATTR Value 0.1
SYMBOL res 5872 2944 M0
SYMATTR InstName R72
SYMATTR Value 0.1
SYMBOL res 5984 2864 M0
SYMATTR InstName R73
SYMATTR Value 180
SYMBOL res 6128 2864 M0
SYMATTR InstName R74
SYMATTR Value 400
SYMBOL npn 5472 2688 M0
SYMATTR InstName Q53
SYMATTR Value Qmj21194
SYMBOL npn 5328 2688 M0
SYMATTR InstName Q54
SYMATTR Value Qmj21194
SYMBOL pnp 5472 3152 R180
SYMATTR InstName Q55
SYMATTR Value Qmj21193
SYMBOL pnp 5328 3152 R180
SYMATTR InstName Q56
SYMATTR Value Qmj21193
SYMBOL res 5280 2800 M0
SYMATTR InstName R75
SYMATTR Value 0.1
SYMBOL res 5280 2944 M0
SYMATTR InstName R76
SYMATTR Value 0.1
SYMBOL res 5424 2800 M0
SYMATTR InstName R77
SYMATTR Value 0.1
SYMBOL res 5424 2944 M0
SYMATTR InstName R78
SYMATTR Value 0.1
SYMBOL npn 5168 2688 M0
SYMATTR InstName Q57
SYMATTR Value Qmj21194
SYMBOL pnp 5168 3152 R180
SYMATTR InstName Q58
SYMATTR Value Qmj21193
SYMBOL res 5120 2800 M0
SYMATTR InstName R79
SYMATTR Value 0.1
SYMBOL res 5120 2944 M0
SYMATTR InstName R80
SYMATTR Value 0.1
SYMBOL npn 5008 2688 M0
SYMATTR InstName Q59
SYMATTR Value Qmj21194
SYMBOL npn 4864 2688 M0
SYMATTR InstName Q60
SYMATTR Value Qmj21194
SYMBOL pnp 5008 3152 R180
SYMATTR InstName Q61
SYMATTR Value Qmj21193
SYMBOL pnp 4864 3152 R180
SYMATTR InstName Q62
SYMATTR Value Qmj21193
SYMBOL res 4816 2800 M0
SYMATTR InstName R81
SYMATTR Value 0.1
SYMBOL res 4816 2944 M0
SYMATTR InstName R82
SYMATTR Value 0.1
SYMBOL res 4960 2800 M0
SYMATTR InstName R83
SYMATTR Value 0.1
SYMBOL res 4960 2944 M0
SYMATTR InstName R84
SYMATTR Value 0.1
SYMBOL Opamps\\opamp2 7424 3136 M0
SYMATTR InstName U2
SYMATTR Value TL084
SYMBOL Opamps\\opamp2 7904 3136 R0
SYMATTR InstName U3
SYMATTR Value TL084
SYMBOL Opamps\\opamp2 8032 2320 R90
SYMATTR InstName U4
SYMATTR Value TL084
SYMBOL Opamps\\opamp2 7328 2320 M90
SYMATTR InstName U5
SYMATTR Value TL084
SYMBOL npn 6400 2864 M0
SYMATTR InstName Q3
SYMATTR Value BC547C
SYMBOL res 6480 2752 M0
SYMATTR InstName R12
SYMATTR Value 5k
SYMBOL res 6432 2912 M0
SYMATTR InstName R13
SYMATTR Value 1k
SYMBOL res 6352 2736 M0
SYMATTR InstName R20
SYMATTR Value 400
SYMBOL pnp 6256 2896 R180
SYMATTR InstName Q6
SYMATTR Value BC857C
SYMBOL cap 8336 3056 R90
WINDOW 0 0 32 VBottom 2
WINDOW 3 32 32 VTop 2
SYMATTR InstName C2
SYMATTR Value 1m
SYMATTR SpiceLine Rser=0.1
SYMBOL res 8368 2960 R0
SYMATTR InstName R21
SYMATTR Value 23620
SYMBOL res 8368 3152 R0
SYMATTR InstName R28
SYMATTR Value 380
SYMBOL npn 8432 3024 R0
SYMATTR InstName Q7
SYMATTR Value BC547C
SYMBOL res 8480 3152 R0
SYMATTR InstName R37
SYMATTR Value 120
SYMBOL res 8480 2848 R0
SYMATTR InstName R39
SYMATTR Value 5880
SYMBOL res 8224 3056 R90
WINDOW 0 0 56 VBottom 2
WINDOW 3 32 56 VTop 2
SYMATTR InstName R40
SYMATTR Value 1k
SYMBOL res 8240 3088 R0
SYMATTR InstName R45
SYMATTR Value 1k
SYMBOL Opamps\\opamp2 8720 2896 R0
SYMATTR InstName U6
SYMATTR Value TL084
SYMBOL cap 7088 3040 M90
WINDOW 0 0 32 VBottom 2
WINDOW 3 32 32 VTop 2
SYMATTR InstName C9
SYMATTR Value 1m
SYMATTR SpiceLine Rser=0.1
SYMBOL res 7056 2944 M0
SYMATTR InstName R38
SYMATTR Value 23620
SYMBOL res 7056 3136 M0
SYMATTR InstName R85
SYMATTR Value 380
SYMBOL npn 6992 3008 M0
SYMATTR InstName Q20
SYMATTR Value BC547C
SYMBOL res 6944 3136 M0
SYMATTR InstName R86
SYMATTR Value 120
SYMBOL res 6944 2832 M0
SYMATTR InstName R87
SYMATTR Value 5880
SYMBOL res 7200 3040 M90
WINDOW 0 0 56 VBottom 2
WINDOW 3 32 56 VTop 2
SYMATTR InstName R88
SYMATTR Value 1k
SYMBOL res 7184 3072 M0
SYMATTR InstName R89
SYMATTR Value 1k
SYMBOL Opamps\\opamp2 6704 2880 M0
SYMATTR InstName U7
SYMATTR Value TL084
SYMBOL res 9664 2176 R90
WINDOW 0 0 56 VBottom 2
WINDOW 3 32 56 VTop 2
SYMATTR InstName R6
SYMATTR Value 310k
SYMBOL res 9472 2192 R0
SYMATTR InstName R18
SYMATTR Value 1k
SYMBOL Opamps\\opamp2 4064 16 M180
SYMATTR InstName U8
SYMATTR Value TL084
SYMBOL res 3824 -80 R90
WINDOW 0 0 56 VBottom 2
WINDOW 3 32 56 VTop 2
SYMATTR InstName R90
SYMATTR Value 50k
SYMBOL res 3984 -80 R90
WINDOW 0 0 56 VBottom 2
WINDOW 3 32 56 VTop 2
SYMATTR InstName R91
SYMATTR Value 50k
SYMBOL cap 3968 -32 R0
SYMATTR InstName C4
SYMATTR Value 100p
SYMATTR SpiceLine Rser=0.1
SYMBOL cap 3824 -144 R0
SYMATTR InstName C5
SYMATTR Value 100p
SYMATTR SpiceLine Rser=0.1
SYMBOL cap 4304 -64 R90
WINDOW 0 0 32 VBottom 2
WINDOW 3 32 32 VTop 2
SYMATTR InstName C1
SYMATTR Value 300n
SYMATTR SpiceLine Rser=0.1
SYMBOL res 4352 -32 R0
SYMATTR InstName R46
SYMATTR Value 50k
SYMBOL cap 7888 2880 R0
SYMATTR InstName C3
SYMATTR Value 100p
SYMATTR SpiceLine Rser=0.1
SYMBOL cap 7456 3072 R90
WINDOW 0 0 32 VBottom 2
WINDOW 3 32 32 VTop 2
SYMATTR InstName C6
SYMATTR Value 100p
SYMATTR SpiceLine Rser=0.1
SYMBOL cap 7920 3072 R90
WINDOW 0 0 32 VBottom 2
WINDOW 3 32 32 VTop 2
SYMATTR InstName C7
SYMATTR Value 100p
SYMATTR SpiceLine Rser=0.1
TEXT -568 -744 Left 2 !.inc 'TL084.301'
TEXT -576 -720 Left 2 !.inc 'TIP41C.LIB'
TEXT -640 -520 Left 2 !;.fourier 1000 V(n002, n003)
TEXT -576 -696 Left 2 !.inc 'TIP42C.LIB'
TEXT -576 -672 Left 2 !.inc 'MJ21194.LIB'
TEXT -576 -648 Left 2 !.inc 'MJ21193.LIB'
TEXT -576 -624 Left 2 !.inc 'MPSA42.LIB'
TEXT -576 -568 Left 2 !.inc 'MJE350.LIB'
TEXT -608 -456 Left 2 !;.fourier 1000 V(n060)
TEXT 3248 840 Left 6 ;Fuente
TEXT 3528 -184 Left 6 ;Entrada
TEXT 9208 1856 Left 2 !;ac dec 10000 1 10meg
TEXT 7856 3424 Left 2 !.fourier 1000 V(vo1, vo2)
TEXT -608 -416 Left 2 !.inc 'BZX84C15VL.LIB'
TEXT -584 -376 Left 2 !.inc 'PA340P.LIB'
TEXT 9304 1944 Left 2 !.tran 10m

The netlist it stands for:
* V6.asc
Q4 vcc2 N019 N021 0 BC547C
Q5 vcc2 N021 N023 0 Qmj21194
Q13 vcc2 N023 N032 0 Qmj21194
Q14 vcc2 N023 N033 0 Qmj21194
Q15 vcc2 N023 N034 0 Qmj21194
Q16 vee2 N045 N079 0 BC857C
Q17 vee2 N079 N076 0 Qmj21193
Q18 vee2 N076 N065 0 Qmj21193
Q19 vee2 N076 N066 0 Qmj21193
Q27 vee2 N076 N067 0 Qmj21193
R1 N034 vo2 0.1
R2 vo2 N067 0.1
R7 N033 vo2 0.1
R8 N032 vo2 0.1
R9 vo2 N066 0.1
R10 vo2 N065 0.1
R11 N023 N076 180
R16 N021 N079 400
Q34 N044 N047 N045 0 BC547C
R42 N019 N047 5k
R43 N047 N045 1k
R44 N019 N044 400
Q35 N045 N044 N019 0 BC857C
V2 vcc2 0 60
V3 0 vee2 60
V4 vinposta 0 SINE(0 0.5 1000) AC 0.5
Q1 N007 Vin N015 0 BC547C
Q2 N008 N004 N016 0 BC547C
R3 vcc1 N007 2020
R4 vcc1 N008 2020
R5 N017 N015 500
R26 N016 N017 500
R30 N017 vee1 1180
XU1 N042 N043 vcc1 vee1 N049 TL084  ; pins In+ In- V+ V- OUT
R32 N043 N009 1k
R33 N042 N006 1k
R34 N042 0 2k
R35 N049 N043 2k
R27 N045 vee2 20k
Q39 N019 N014 N012 0 PNP
R59 N014 0 3k3
D1 N010 N014 1N4148
D2 vcc2 N010 1N4148
R60 vcc2 N012 60
Q8 vcc2 N023 N035 0 Qmj21194
Q9 vcc2 N023 N036 0 Qmj21194
Q10 vee2 N076 N068 0 Qmj21193
Q11 vee2 N076 N069 0 Qmj21193
R14 N036 vo2 0.1
R15 vo2 N069 0.1
R17 N035 vo2 0.1
R19 vo2 N068 0.1
R47 N041 vee2 20k
Q29 N018 N013 N011 0 PNP
R48 N013 0 3k3
D3 N005 N013 1N4148
D4 vcc2 N005 1N4148
R49 vcc2 N011 60
R41 vo2 vo1 8
R56 N054 N053 32k
R57 N053 N049 16k
R58 N082 0 16k
R61 0 N052 16k
R62 N051 N052 32k
R63 N049 N081 16k
R64 N081 0 32k
R22 vcc1 vcc2 1k
R vee1 vee2 1k
D5 vee1 0 BZX84C15L
D6 0 vcc1 BZX84C15VL
R23 vcc1 vcc2 1k
R25 vee1 vee2 1k
Q36 vcc2 N023 N037 0 Qmj21194
Q37 vee2 N076 N070 0 Qmj21193
R24 N037 vo2 0.1
R29 vo2 N070 0.1
Q38 vcc2 N023 N038 0 Qmj21194
Q40 vcc2 N023 N039 0 Qmj21194
Q41 vee2 N076 N071 0 Qmj21193
Q42 vee2 N076 N072 0 Qmj21193
R31 N039 vo2 0.1
R36 vo2 N072 0.1
R65 N038 vo2 0.1
R66 vo2 N071 0.1
Q43 vcc2 N018 N020 0 BC547C
Q44 vcc2 N020 N022 0 Qmj21194
Q45 vcc2 N022 N031 0 Qmj21194
Q46 vcc2 N022 N030 0 Qmj21194
Q47 vcc2 N022 N029 0 Qmj21194
Q48 vee2 N041 N077 0 BC857C
Q49 vee2 N077 N075 0 Qmj21193
Q50 vee2 N075 N062 0 Qmj21193
Q51 vee2 N075 N061 0 Qmj21193
Q52 vee2 N075 N060 0 Qmj21193
R67 N029 vo1 0.1
R68 vo1 N060 0.1
R69 N030 vo1 0.1
R70 N031 vo1 0.1
R71 vo1 N061 0.1
R72 vo1 N062 0.1
R73 N022 N075 180
R74 N020 N077 400
Q53 vcc2 N022 N028 0 Qmj21194
Q54 vcc2 N022 N027 0 Qmj21194
Q55 vee2 N075 N059 0 Qmj21193
Q56 vee2 N075 N058 0 Qmj21193
R75 N027 vo1 0.1
R76 vo1 N058 0.1
R77 N028 vo1 0.1
R78 vo1 N059 0.1
Q57 vcc2 N022 N026 0 Qmj21194
Q58 vee2 N075 N057 0 Qmj21193
R79 N026 vo1 0.1
R80 vo1 N057 0.1
Q59 vcc2 N022 N025 0 Qmj21194
Q60 vcc2 N022 N024 0 Qmj21194
Q61 vee2 N075 N056 0 Qmj21193
Q62 vee2 N075 N055 0 Qmj21193
R81 N024 vo1 0.1
R82 vo1 N055 0.1
R83 N025 vo1 0.1
R84 vo1 N056 0.1
XU2 N081 N052 vcc1 vee1 N051 TL084  ; pins In+ In- V+ V- OUT
XU3 N082 N053 vcc1 vee1 N054 TL084  ; pins In+ In- V+ V- OUT
XU4 N008 N009 vcc1 vee1 N009 TL084  ; pins In+ In- V+ V- OUT
XU5 N007 N006 vcc1 vee1 N006 TL084  ; pins In+ In- V+ V- OUT
Q3 N040 N046 N041 0 BC547C
R12 N018 N046 5k
R13 N046 N041 1k
R20 N018 N040 400
Q6 N041 N040 N018 0 BC857C
C2 N074 N073 1m Rser=0.1
R21 vcc2 N074 23620
R28 N074 vee2 380
Q7 N050 N074 N080 0 BC547C
R37 N080 vee2 120
R39 vcc2 N050 5880
R40 N073 N054 1k
R45 N073 0 1k
XU6 N050 N045 vcc2 vee2 N045 TL084  ; pins In+ In- V+ V- OUT
C9 N063 N064 1m Rser=0.1
R38 vcc2 N063 23620
R85 N063 vee2 380
Q20 N048 N063 N078 0 BC547C
R86 N078 vee2 120
R87 vcc2 N048 5880
R88 N064 N051 1k
R89 N064 0 1k
XU7 N048 N041 vcc2 vee2 N041 TL084  ; pins In+ In- V+ V- OUT
R6 vo1 N004 310k
R18 N004 0 1k
XU8 N003 N001 vcc1 vee1 N001 TL084  ; pins In+ In- V+ V- OUT
R90 N002 vinposta 50k
R91 N003 N002 50k
C4 N003 0 100p Rser=0.1
C5 N001 N002 100p Rser=0.1
C1 Vin N001 300n Rser=0.1
R46 Vin 0 50k
C3 N043 N049 100p Rser=0.1
C6 N052 N051 100p Rser=0.1
C7 N054 N053 100p Rser=0.1
.model D D
.lib standard.dio
.model NPN NPN
.model PNP PNP
.lib standard.bjt
.inc 'TL084.301'
.inc 'TIP41C.LIB'
;.fourier 1000 V(n002, n003)
.inc 'TIP42C.LIB'
.inc 'MJ21194.LIB'
.inc 'MJ21193.LIB'
.inc 'MPSA42.LIB'
.inc 'MJE350.LIB'
;.fourier 1000 V(n060)
* Fuente
* Entrada
;ac dec 10000 1 10meg
.fourier 1000 V(vo1, vo2)
.inc 'BZX84C15VL.LIB'
.inc 'PA340P.LIB'
.tran 10m
.backanno
.end